# EAGLE design Cube_8x8x8_Mini_Control (EAGLE 9.6.2)
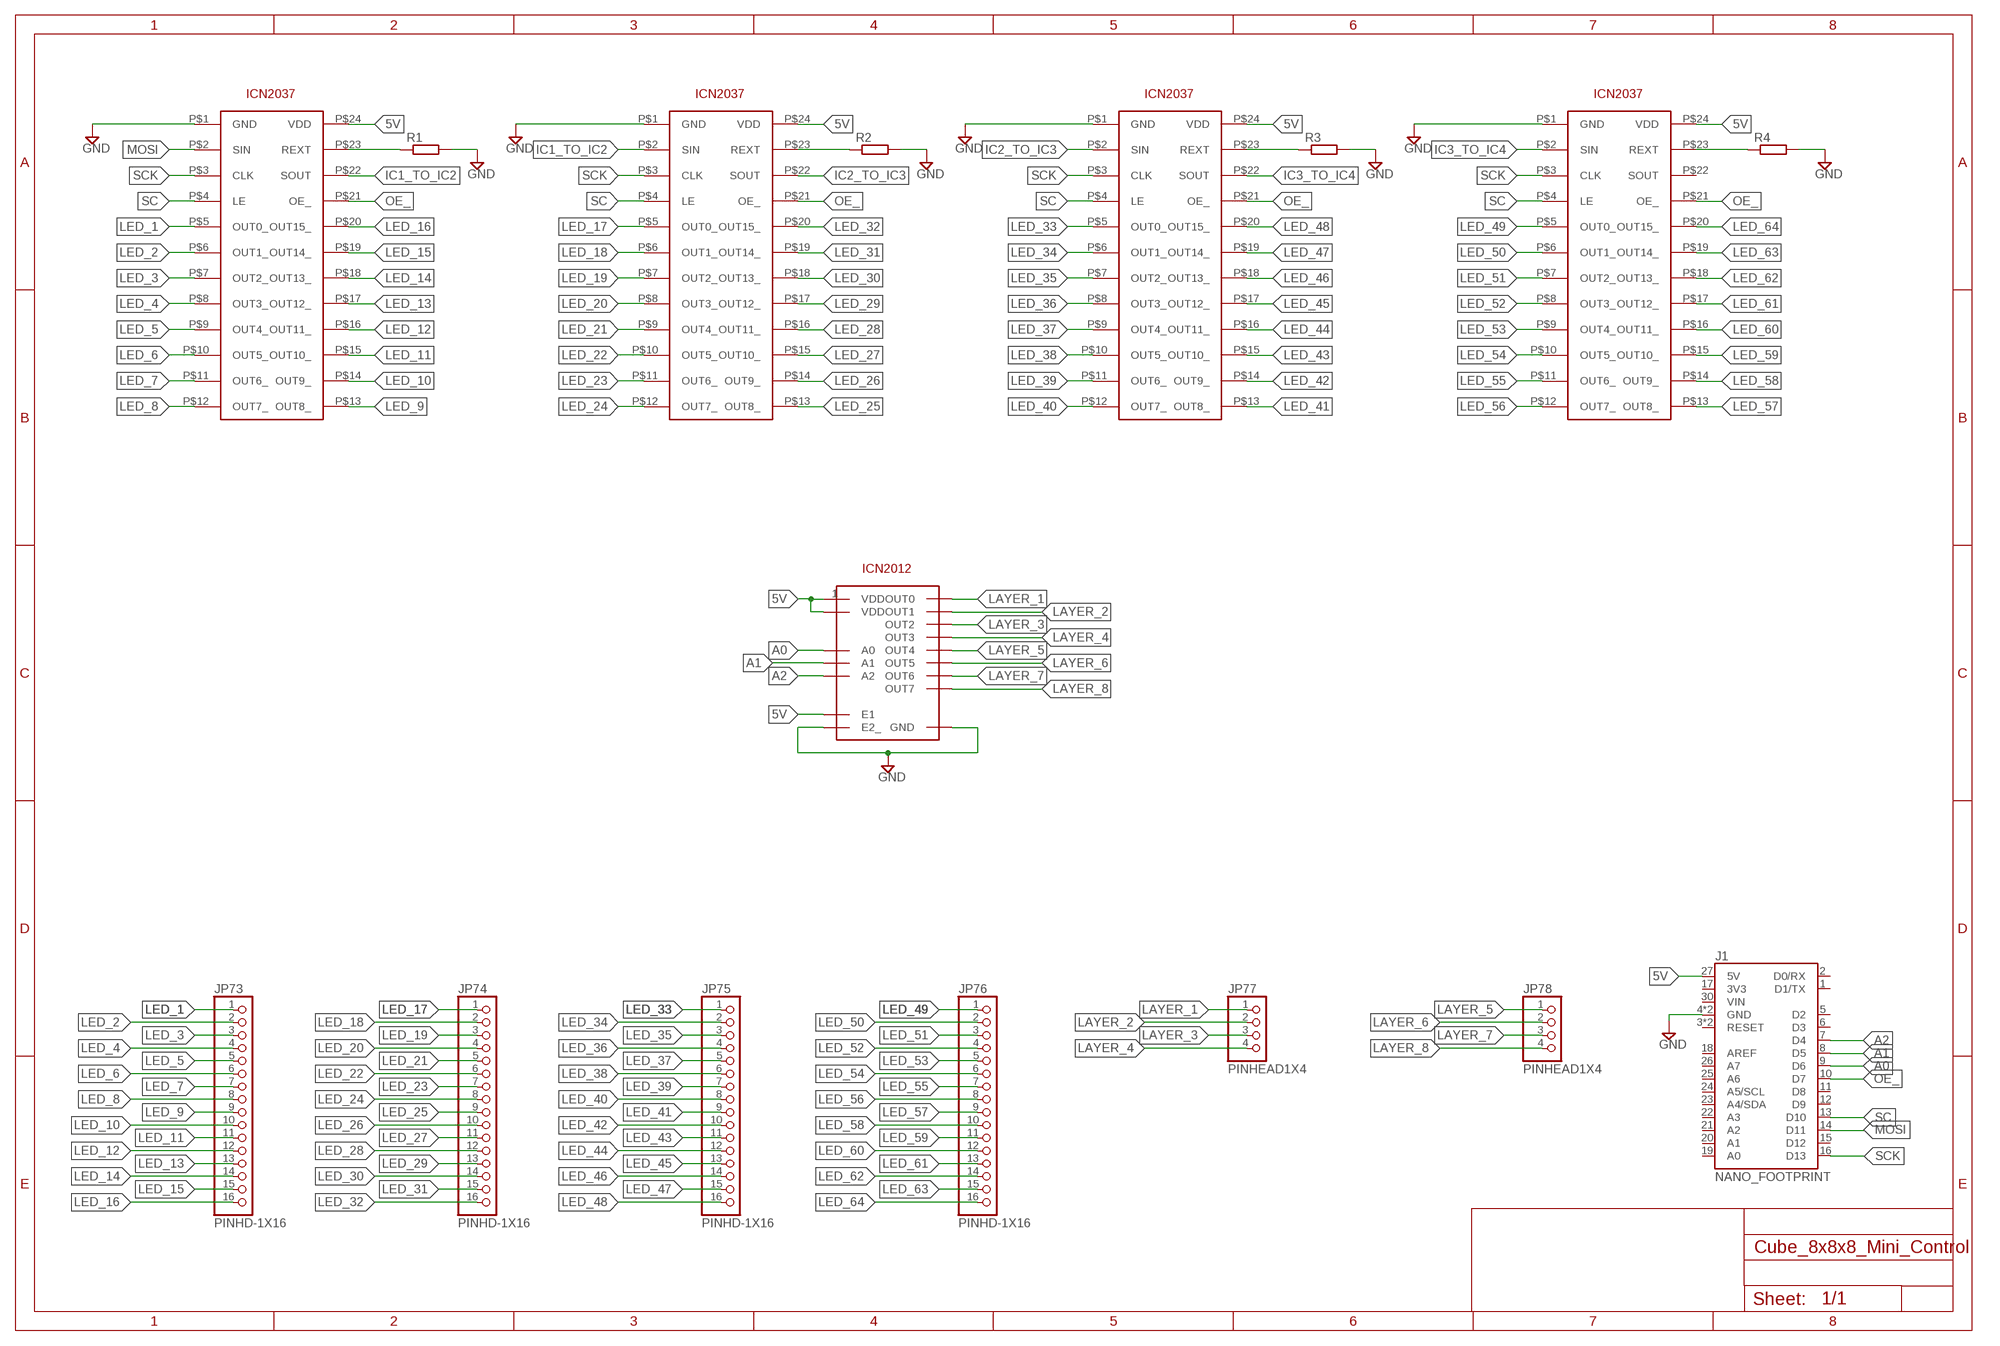
[diagram p0: schematic, sheet 1]

## Parts
J1  NANO_FOOTPRINT  [NANO]
JP73  PINHD-1X16  [2X16]
JP74  PINHD-1X16  [2X16]
JP75  PINHD-1X16  [2X16]
JP76  PINHD-1X16  [2X16]
JP77  PINHEAD1X4  [2X04]
JP78  PINHEAD1X4  [2X04]
R1  R-EU_R1206  [R1206]
R2  R-EU_R1206  [R1206]
R3  R-EU_R1206  [R1206]
R4  R-EU_R1206  [R1206]
U1  ICN2037  [SSOP24-P-150-0.635]
U2  ICN2037  [SSOP24-P-150-0.635]
U3  ICN2037  [SSOP24-P-150-0.635]
U4  ICN2037  [SSOP24-P-150-0.635]
U5  ICN2012  [SOP16]

## Nets
5V: J1.27(5V) U1.P$24(VDD) U2.P$24(VDD) U3.P$24(VDD) U4.P$24(VDD) U5.1(VDD) U5.7(E1) U5.9(VDD)
A0: J1.9(D6) U5.15(A0)
A1: J1.8(D5) U5.16(A1)
A2: J1.7(D4) U5.2(A2)
GND: J1.4(GND) J1.29(GND) R1.2 R2.2 R3.2 R4.2 U1.P$1(GND) U2.P$1(GND) U3.P$1(GND) U4.P$1(GND) U5.8(GND) U5.10(E2_)
IC1_TO_IC2: U1.P$22(SOUT) U2.P$2(SIN)
IC2_TO_IC3: U2.P$22(SOUT) U3.P$2(SIN)
IC3_TO_IC4: U3.P$22(SOUT) U4.P$2(SIN)
LAYER_1: JP77.1 U5.3(OUT0)
LAYER_2: JP77.2 U5.4(OUT1)
LAYER_3: JP77.3 U5.5(OUT2)
LAYER_4: JP77.4 U5.6(OUT3)
LAYER_5: JP78.1 U5.11(OUT4)
LAYER_6: JP78.2 U5.12(OUT5)
LAYER_7: JP78.3 U5.13(OUT6)
LAYER_8: JP78.4 U5.14(OUT7)
LED_1: JP73.1 U1.P$5(OUT0_)
LED_2: JP73.2 U1.P$6(OUT1_)
LED_3: JP73.3 U1.P$7(OUT2_)
LED_4: JP73.4 U1.P$8(OUT3_)
LED_5: JP73.5 U1.P$9(OUT4_)
LED_6: JP73.6 U1.P$10(OUT5_)
LED_7: JP73.7 U1.P$11(OUT6_)
LED_8: JP73.8 U1.P$12(OUT7_)
LED_9: JP73.9 U1.P$13(OUT8_)
LED_10: JP73.10 U1.P$14(OUT9_)
LED_11: JP73.11 U1.P$15(OUT10_)
LED_12: JP73.12 U1.P$16(OUT11_)
LED_13: JP73.13 U1.P$17(OUT12_)
LED_14: JP73.14 U1.P$18(OUT13_)
LED_15: JP73.15 U1.P$19(OUT14_)
LED_16: JP73.16 U1.P$20(OUT15_)
LED_17: JP74.1 U2.P$5(OUT0_)
LED_18: JP74.2 U2.P$6(OUT1_)
LED_19: JP74.3 U2.P$7(OUT2_)
LED_20: JP74.4 U2.P$8(OUT3_)
LED_21: JP74.5 U2.P$9(OUT4_)
LED_22: JP74.6 U2.P$10(OUT5_)
LED_23: JP74.7 U2.P$11(OUT6_)
LED_24: JP74.8 U2.P$12(OUT7_)
LED_25: JP74.9 U2.P$13(OUT8_)
LED_26: JP74.10 U2.P$14(OUT9_)
LED_27: JP74.11 U2.P$15(OUT10_)
LED_28: JP74.12 U2.P$16(OUT11_)
LED_29: JP74.13 U2.P$17(OUT12_)
LED_30: JP74.14 U2.P$18(OUT13_)
LED_31: JP74.15 U2.P$19(OUT14_)
LED_32: JP74.16 U2.P$20(OUT15_)
LED_33: JP75.1 U3.P$5(OUT0_)
LED_34: JP75.2 U3.P$6(OUT1_)
LED_35: JP75.3 U3.P$7(OUT2_)
LED_36: JP75.4 U3.P$8(OUT3_)
LED_37: JP75.5 U3.P$9(OUT4_)
LED_38: JP75.6 U3.P$10(OUT5_)
LED_39: JP75.7 U3.P$11(OUT6_)
LED_40: JP75.8 U3.P$12(OUT7_)
LED_41: JP75.9 U3.P$13(OUT8_)
LED_42: JP75.10 U3.P$14(OUT9_)
LED_43: JP75.11 U3.P$15(OUT10_)
LED_44: JP75.12 U3.P$16(OUT11_)
LED_45: JP75.13 U3.P$17(OUT12_)
LED_46: JP75.14 U3.P$18(OUT13_)
LED_47: JP75.15 U3.P$19(OUT14_)
LED_48: JP75.16 U3.P$20(OUT15_)
LED_49: JP76.1 U4.P$5(OUT0_)
LED_50: JP76.2 U4.P$6(OUT1_)
LED_51: JP76.3 U4.P$7(OUT2_)
LED_52: JP76.4 U4.P$8(OUT3_)
LED_53: JP76.5 U4.P$9(OUT4_)
LED_54: JP76.6 U4.P$10(OUT5_)
LED_55: JP76.7 U4.P$11(OUT6_)
LED_56: JP76.8 U4.P$12(OUT7_)
LED_57: JP76.9 U4.P$13(OUT8_)
LED_58: JP76.10 U4.P$14(OUT9_)
LED_59: JP76.11 U4.P$15(OUT10_)
LED_60: JP76.12 U4.P$16(OUT11_)
LED_61: JP76.13 U4.P$17(OUT12_)
LED_62: JP76.14 U4.P$18(OUT13_)
LED_63: JP76.15 U4.P$19(OUT14_)
LED_64: JP76.16 U4.P$20(OUT15_)
MOSI: J1.14(D11) U1.P$2(SIN)
N$1: R1.1 U1.P$23(REXT)
N$2: R2.1 U2.P$23(REXT)
N$3: R3.1 U3.P$23(REXT)
N$4: R4.1 U4.P$23(REXT)
OE_: J1.10(D7) U1.P$21(OE_) U2.P$21(OE_) U3.P$21(OE_) U4.P$21(OE_)
SC: J1.13(D10) U1.P$4(LE) U2.P$4(LE) U3.P$4(LE) U4.P$4(LE)
SCK: J1.16(D13) U1.P$3(CLK) U2.P$3(CLK) U3.P$3(CLK) U4.P$3(CLK)
Unconnected: J1.1(D1/TX) J1.2(D0/RX) J1.3(RESET) J1.5(D2) J1.6(D3) J1.11(D8) J1.12(D9) J1.15(D12) J1.17(3V3) J1.18(AREF) J1.19(A0) J1.20(A1) J1.21(A2) J1.22(A3) J1.23(A4/SDA) J1.24(A5/SCL) J1.25(A6) J1.26(A7) J1.28(RESET) J1.30(VIN) U4.P$22(SOUT)

## Library data of the parts
J1 = SparkFun-Boards:NANO_FOOTPRINT: Generic Nano Footprint
JP73-JP76 = pinhead1x16:PINHD-1X16
JP77 JP78 = pinhead1x4:PINHEAD1X4
R1-R4 = rcl:R-EU_: RESISTOR, European symbol; SPICEPREFIX: R
U1-U4 = ICN2037:ICN2037
U5 = ICN2012:ICN2012

## Board
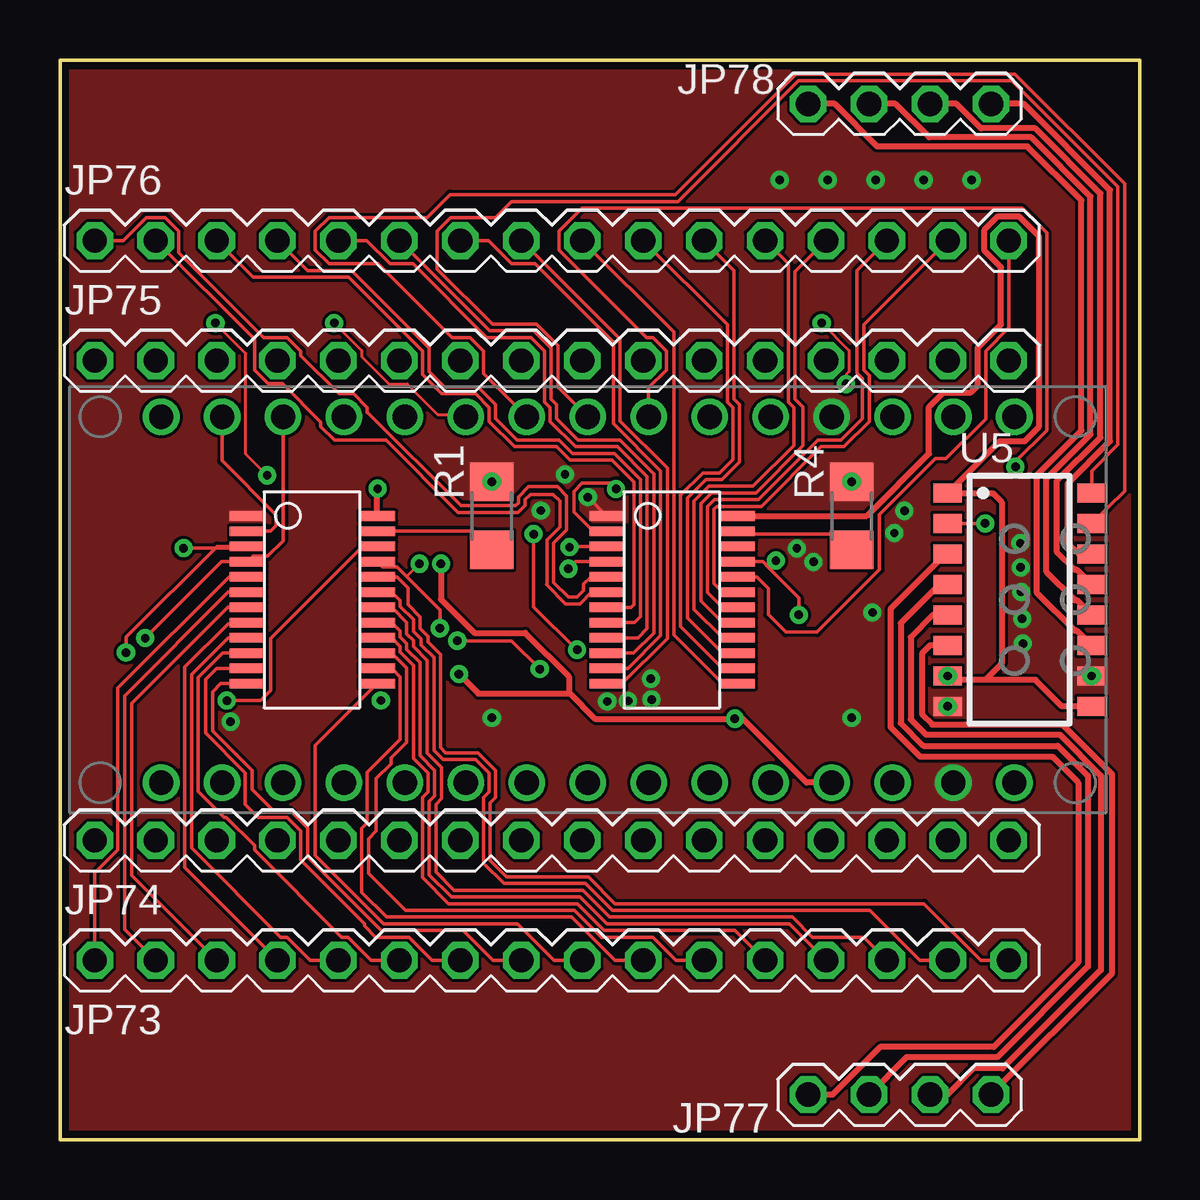
[diagram p1: board, top side]
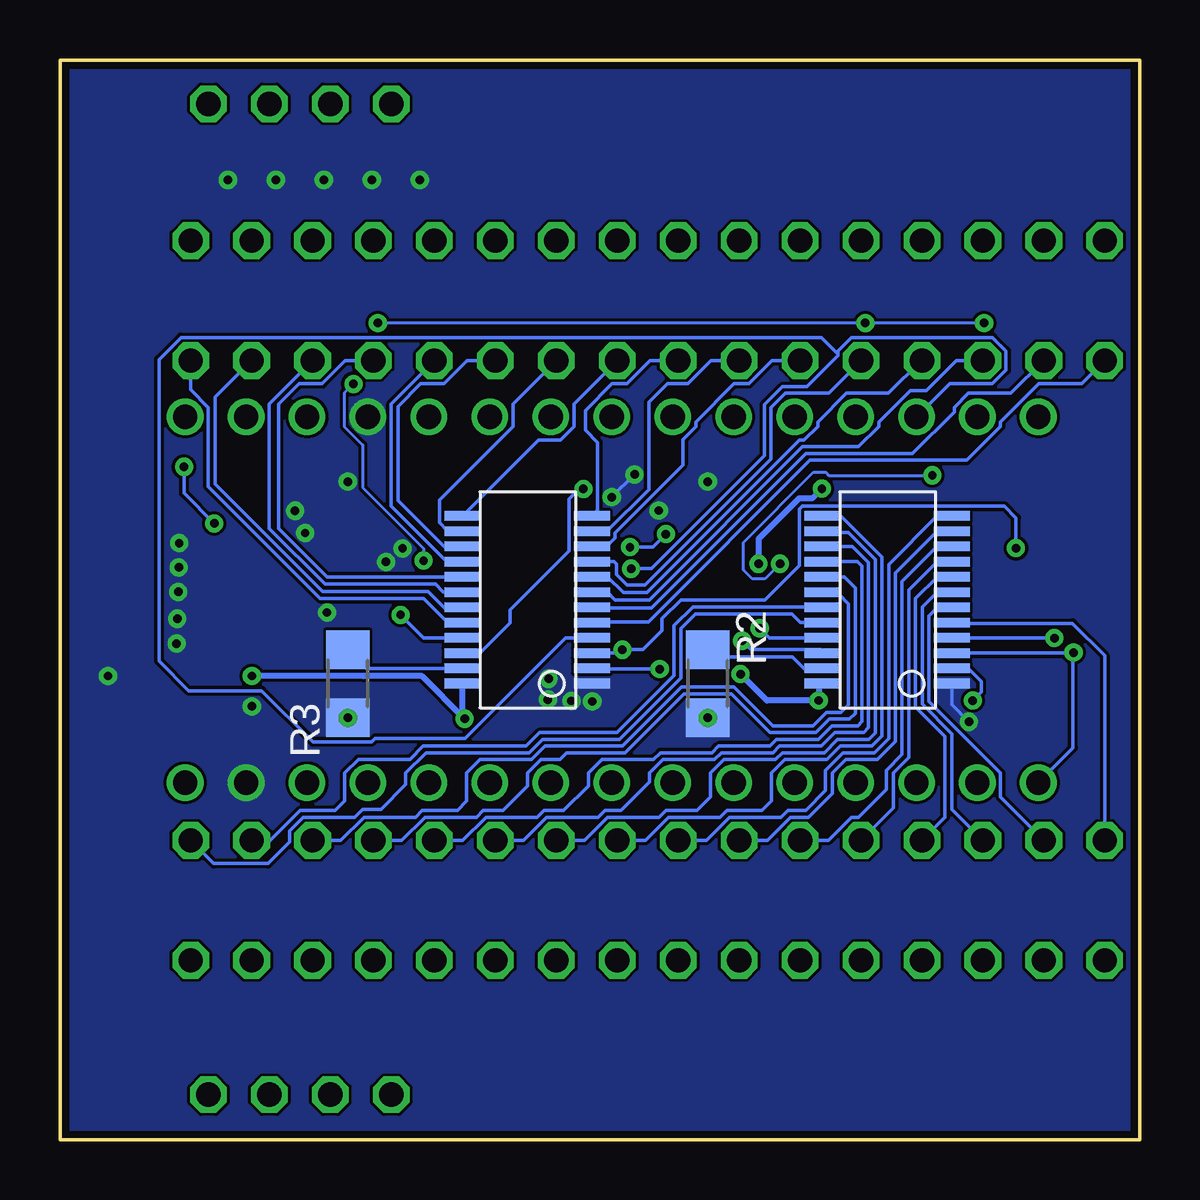
[diagram p2: board, bottom side, seen from below]

Size 45 x 45 mm. Coordinates in mm from the lower left corner, seen from the top.
Outline: 0,0 0,45 45,45 45,0 0,0
Copper layers (1*16): Top 0.035mm / dielectric 1.5mm / Bottom 0.035mm
Design rules "reglejlcpcb *": minimum track width 5mil, minimum drill 0.35mm, track to track 5mil, track to pad 5mil, pad to pad 5mil, via to via 5mil, smd to smd 5mil, copper to edge 0.3mm, drill to drill 20mil, minimum pad ring 10mil, minimum via ring 8mil, stop-mask expansion 4mil, vias tented up to drill 0mil, thermal gap 10mil

### Footprints (pad centres in the part's own frame; a part is rotated, then mirrored left to right if it is on the bottom)
NANO = drill 1.016: 1 -7.62,17.78; 2 -7.62,15.24; 3 -7.62,12.7; 4 -7.62,10.16; 5 -7.62,7.62; 6 -7.62,5.08; 7 -7.62,2.54; 8 -7.62,0; 9 -7.62,-2.54; 10 -7.62,-5.08; 11 -7.62,-7.62; 12 -7.62,-10.16; 13 -7.62,-12.7; 14 -7.62,-15.24; 15 -7.62,-17.78; 16 7.62,-17.78; 17 7.62,-15.24; 18 7.62,-12.7; 19 7.62,-10.16; 20 7.62,-7.62; 21 7.62,-5.08; 22 7.62,-2.54; 23 7.62,0; 24 7.62,2.54; 25 7.62,5.08; 26 7.62,7.62; 27 7.62,10.16; 28 7.62,12.7; 29 7.62,15.24; 30 7.62,17.78
2X16 = drill 1.016 octagon: 1 -19.05,1.27; 2 -16.51,1.27; 3 -13.97,1.27; 4 -11.43,1.27; 5 -8.89,1.27; 6 -6.35,1.27; 7 -3.81,1.27; 8 -1.27,1.27; 9 1.27,1.27; 10 3.81,1.27; 11 6.35,1.27; 12 8.89,1.27; 13 11.43,1.27; 14 13.97,1.27; 15 16.51,1.27; 16 19.05,1.27
2X04 = drill 1.016 octagon: 1 -3.81,1.27; 2 -1.27,1.27; 3 1.27,1.27; 4 3.81,1.27
R1206 = smd 1.6 x 1.803: 1 -1.422,0; 2 1.422,0
SSOP24-P-150-0.635 = smd 0.4 x 1.5: P$1 -3.491,-2.674; P$2 -2.856,-2.674; P$3 -2.221,-2.674; P$4 -1.586,-2.674; P$5 -0.951,-2.674; P$6 -0.316,-2.674; P$7 0.319,-2.674; P$8 0.954,-2.674; P$9 1.589,-2.674; P$10 2.224,-2.674; P$11 2.859,-2.674; P$12 3.494,-2.674; P$13 3.494,2.724; P$14 2.859,2.724; P$15 2.224,2.724; P$16 1.589,2.724; P$17 0.954,2.724; P$18 0.319,2.724; P$19 -0.316,2.724; P$20 -0.951,2.724; P$21 -1.586,2.724; P$22 -2.221,2.724; P$23 -2.856,2.724; P$24 -3.491,2.724
SOP16 = smd 0.8 x 1.2: 1 -4.445,-3; 2 -3.175,-3; 3 -1.905,-3; 4 -0.635,-3; 5 0.635,-3; 6 1.905,-3; 7 3.175,-3; 8 4.445,-3; 9 4.445,3; 10 3.175,3; 11 1.905,3; 12 0.635,3; 13 -0.635,3; 14 -1.905,3; 15 -3.175,3; 16 -4.445,3

### Placement (x,y rotation side)
J1  22,22.5 270 top
JP73  20.5,6.2 0 top
JP74  20.5,11.2 0 top
JP75  20.5,31.2 0 top
JP76  20.5,36.2 0 top
JP77  35,0.6 0 top
JP78  35,41.9 0 top
R1  18,26 90 top
R2  18,19 270 bottom
R3  33,19 270 bottom
R4  33,26 90 top
U1  10.5,22.5 270 top
U2  10.5,22.5 90 bottom
U3  25.5,22.5 90 bottom
U4  25.5,22.5 270 top
U5  40,22.5 270 top

### Tracks (layer width: path | path; a pad name or v marks a point on that pad's centre or on a via)
5V  (via drill 0.35)
  Top 0.152: 13.22,27.11 v13.24,27.13
  Top 0.254: 38.57,19.16 39.25,19.84 39.25,26.57 38.88,26.95 U5.1 39.16,29.1 40.2,29.1 40.8,29.7 40.8,37.66 39.97,38.49 39.1,38.49 38.53,37.92 38.53,37.05 39.22,36.36 39.22,33.97 38.26,33.01 38.26,31.43 37.96,31.14 36.82,31.14 36.22,30.54 36.22,28.59 33.63,25.99 U4.P$24 | 38.57,19.16 40.66,19.16 41.77,18.05 U5.9 | 38.57,19.16 37.28,19.16 37.12,19.32 U5.7 | J1.27 31.12,14.88 28.46,17.54 v28.13,17.54 22.3,17.54 21.25,18.59 | U1.P$24 13.22,27.11 | v16.63,19.4 17.44,18.59 21.25,18.59 | v15.88,24 15.88,22.52 17.28,21.12 19.39,21.12 21.21,19.3 21.21,18.63 21.25,18.59
  Bottom 0.254: U3.P$24 28.22,17.63 v28.13,17.54 29.9,19.31 32.36,19.31 32.37,19.32 U5.7 | U2.P$24 13.37,18.86 v13.37,18.3 15.53,18.3 v16.63,19.4 | v13.24,27.13 13.64,26.73 14.19,26.73 15.88,25.04 v15.88,24
  other vias: 37,19.32
A0
  Top 0.152: U5.15 43.67,26.34 43.68,26.34 44.38,27.04 44.38,39.83 39.8,44.41 30.67,44.41 25.65,39.39 16.26,39.39 15.3,38.44 11.21,38.44 10.64,37.87 10.64,37.07 11.21,36.51 13.27,36.51 16.34,33.44 17.09,33.44 17.66,32.87 17.66,31.93 J1.9
A1
  Top 0.152: U5.16 43,27.87 44.1,28.97 44.1,39.72 39.68,44.13 30.79,44.13 25.75,39.1 18.83,39.1 18.16,38.44 16.29,38.44 15.72,37.87 15.72,36.29 18.02,33.99 19.86,33.99 20.75,33.1 20.75,31.37 J1.8
A2  (via drill 0.35)
  Top 0.152: U5.2 v38.56,25.68 v38.57,25.68 | v39.83,28.04 39.83,28.27 41.13,29.56 41.13,37.8 40.11,38.82 21.75,38.82 20.8,37.87 20.8,37.07 24.44,33.44 24.71,33.44 25.27,32.87 25.27,32.07 24.54,31.34 J1.7
  Bottom 0.152: v38.57,25.68 39.83,26.94 v39.83,28.04
GND  (via drill 0.35)
  Top 0.152: U4.P$1 22.79,25.99 v22,26.78
  Bottom 0.127: 18.03,27.43 R1.2
  Bottom 0.152: v21.05,27.73 v22,26.78 | U2.P$1 7.83,18.13 v7.11,17.41
  other vias: 18,17.58 33,17.58 33,27.42 18,27.42 37,18.05 43,19.32 33.87,21.97 24.63,19.21 24.66,18.34 23.68,18.28 22.81,18.26 30.72,24.64 31.41,24.08 40.03,24.86 40.05,23.85 40.07,22.83 40.11,21.71 40.14,20.67 30,40 32,40 34,40 36,40 38,40 20.04,26.22 35.2,26.21 34.78,25.28
  pour Top (no thermals): -0.5,45.5 -0.5,-0.5 45.5,-0.5 45.5,45.5
  pour Bottom (no thermals): -1,46 -1,-1 46,-1 46,46
IC1_TO_IC2  (via drill 0.35)
  Top 0.152: U1.P$22 13.14,24.64 12.54,24.64 8.78,20.88 8.78,18.72 8.36,18.3 v6.95,18.3
  Bottom 0.152: v6.95,18.3 6.6,18.65 6.6,19.1 7.14,19.64 U2.P$2
IC2_TO_IC3  (via drill 0.35)
  Top 0.152: v16.56,20.79 18.82,20.79 v20,19.61
  Bottom 0.152: v16.56,20.79 16.19,20.42 13.28,20.42 13.22,20.36 U2.P$22 | v20,19.61 22.79,19.61 U3.P$2
IC3_TO_IC4  (via drill 0.35)
  Top 0.152: v23.18,27.12 22.93,27.37 21.77,27.37 21.42,27.02 21.42,26.16 22.22,25.36 U4.P$2
  Bottom 0.152: v23.18,27.12 23.36,27.12 23.78,26.7 23.78,24.53 26.24,22.07 26.24,21.53 27.49,20.28 U3.P$22
LAYER_1
  Top 0.254: U5.3 36.91,24.41 34.62,22.11 34.62,17.2 35.85,15.96 41.35,15.96 42.44,14.88 42.44,7.38 38.92,3.86 34.19,3.86 32.2,1.87 JP77.1
LAYER_2
  Top 0.254: U5.4 36.66,23.14 35.05,21.52 35.05,17.36 35.99,16.41 41.59,16.41 42.85,15.16 42.85,7.21 39.07,3.43 35.29,3.43 JP77.2
LAYER_3
  Top 0.254: U5.5 36.39,21.86 35.46,20.94 35.46,17.51 36.1,16.88 41.67,16.88 43.39,15.16 43.39,7.06 39.29,2.96 38.08,2.96 36.99,1.87 JP77.3
LAYER_4
  Top 0.254: U5.6 36.27,20.59 35.93,20.26 35.93,17.72 36.36,17.3 41.79,17.3 43.85,15.24 43.85,6.92 JP77.4
LAYER_5
  Top 0.254: U5.11 42.38,21.21 42.3,21.21 40.73,22.78 40.73,27.71 42.58,29.55 42.58,39.15 40.33,41.39 34.07,41.39 32.29,43.17 JP78.1
LAYER_6
  Top 0.254: U5.12 42.38,22.48 42.3,22.48 41.12,23.66 41.12,27.56 42.96,29.4 42.96,39.3 40.49,41.77 36.23,41.77 34.83,43.17 JP78.2
LAYER_7
  Top 0.254: U5.13 42.38,23.75 42.3,23.75 41.56,24.49 41.56,27.46 43.37,29.27 43.37,39.43 40.65,42.15 38.39,42.15 37.37,43.17 JP78.3
LAYER_8
  Top 0.254: U5.14 42.48,24.41 41.99,24.89 41.99,27.33 43.77,29.11 43.77,39.58 40.18,43.17 JP78.4
LED_1
  Top 0.152: JP73.1 1.45,11.11 2.42,12.07 2.42,18.82 7.05,23.45 U1.P$5
LED_2
  Top 0.152: U1.P$6 7.02,22.82 2.7,18.5 2.7,8.76 JP73.2
LED_3
  Top 0.152: U1.P$7 7.02,22.18 7,22.2 2.98,18.18 2.98,11.02 JP73.3
LED_4
  Top 0.152: U1.P$8 7.78,21.5 7,21.5 5.2,19.7 5.2,11.34 JP73.4
LED_5
  Top 0.152: U1.P$9 7.82,20.9 7,20.9 5.48,19.38 5.48,12.16 9.2,8.44 9.47,8.44 10.44,7.47 JP73.5
LED_6
  Top 0.152: JP73.6 12.97,7.47 12.01,8.44 11.74,8.44 8.11,12.07 8.11,12.26 6.93,13.44 6.84,13.44 5.76,14.52 5.76,19.26 6.77,20.28 U1.P$10
LED_7
  Top 0.152: U1.P$11 6.53,19.64 6.07,19.18 6.07,16.94 7.72,15.28 7.72,13.97 8.27,13.44 9.47,13.44 10.04,12.87 10.04,11.66 12.7,9 12.7,8.9 13.16,8.44 14.55,8.44 15.52,7.47 JP73.7
LED_8
  Top 0.152: U1.P$12 6.71,19.01 6.37,18.67 6.37,17.03 8.01,15.4 8.01,14.6 8.89,13.71 9.59,13.71 10.31,12.99 10.31,11.78 13.38,8.71 16.81,8.71 18.05,7.47 JP73.8
LED_9
  Top 0.152: U1.P$13 10.64,16.43 10.64,11.85 13.5,8.99 19.07,8.99 20.59,7.47 JP73.9
LED_10
  Top 0.152: U1.P$14 13.26,19.61 13.86,19.61 14.18,19.29 14.18,16.68 12.8,15.3 12.8,13.21 12.57,12.97 12.57,10.31 13.61,9.27 21.33,9.27 23.14,7.47 JP73.10
LED_11
  Top 0.152: U1.P$15 13.24,20.3 13.81,20.3 14.46,19.65 14.46,16.56 13.8,15.9 13.8,15.66 13.19,15.05 13.19,12.87 12.86,12.54 12.86,11.1 14.4,9.55 21.45,9.55 22.57,8.44 24.71,8.44 25.68,7.47 JP73.11
LED_12
  Top 0.152: U1.P$16 13.26,20.88 13.86,20.88 14.18,20.56 14.18,20.32 14.74,19.76 14.74,15.89 15.35,15.28 15.35,14.48 15.12,14.25 15.12,10.92 16.2,9.83 21.56,9.83 22.68,8.71 28.14,8.71 JP73.12
LED_13
  Top 0.152: U1.P$17 13.24,21.57 13.81,21.57 14.18,21.2 14.18,20.96 14.46,20.68 14.46,20.44 15.02,19.88 15.02,16 15.62,15.4 15.62,14.32 15.39,14.1 15.39,11.03 16.32,10.11 21.68,10.11 22.8,8.99 30.41,8.99 JP73.13
LED_14
  Top 0.152: U1.P$18 13.26,22.15 13.86,22.15 14.46,21.55 14.46,21.07 14.74,20.79 14.74,20.55 15.31,19.98 15.31,16.11 15.91,15.5 15.91,14.21 15.67,13.97 15.67,11.15 16.43,10.39 21.8,10.39 22.91,9.27 30.52,9.27 31.36,8.44 33.51,8.44 JP73.14
LED_15
  Top 0.152: JP73.15 35.84,7.47 33.75,9.55 23.03,9.55 21.91,10.67 18.5,10.67 17.66,11.52 17.66,14.25 17.89,14.48 17.89,15.28 17.32,15.85 15.96,15.85 15.59,16.22 15.59,20.09 15.06,20.62 15.06,20.86 14.74,21.19 14.74,21.67 14.18,22.23 14.18,22.47 13.86,22.79 13.26,22.79 U1.P$19
LED_16
  Top 0.152: U1.P$20 14.05,23.45 14.5,23 14.5,22.3 15.02,21.78 15.02,21.3 15.34,20.98 15.34,20.74 15.87,20.21 15.87,16.34 16.08,16.12 17.44,16.12 18.16,15.4 18.16,14.27 17.93,14.04 17.93,11.63 18.62,10.95 22.03,10.95 23.14,9.83 36.01,9.83 38.38,7.47 JP73.16
LED_17
  Bottom 0.152: U2.P$5 7.79,21.52 2.79,21.52 1.45,20.18 JP74.1
LED_18
  Bottom 0.152: U2.P$6 7.89,22.25 8.36,22.25 8.78,21.83 8.78,18.26 5.79,15.28 5.79,14.28 JP74.2
LED_19
  Bottom 0.152: JP74.3 7.83,13.77 7.83,16.92 9.06,18.15 9.06,22.19 8.46,22.79 7.86,22.79 U2.P$7
LED_20
  Bottom 0.152: U2.P$8 7.84,23.47 8.41,23.47 9.34,22.54 9.34,18.03 8.11,16.8 8.11,13.44 JP74.4
LED_21
  Bottom 0.152: U2.P$9 7.91,24.01 8.51,24.01 9.62,22.9 9.62,15.93 10.27,15.28 10.27,13.81 JP74.5
LED_22
  Bottom 0.152: U2.P$10 7.86,24.69 8.46,24.69 9.9,23.25 9.9,16.04 10.54,15.4 10.54,14.6 11.71,13.44 12.01,13.44 12.97,12.47 JP74.6
LED_23
  Bottom 0.152: U2.P$11 7.84,25.38 8.41,25.38 10.18,23.61 10.18,16.6 10.93,15.85 12.24,15.85 12.8,15.28 12.8,14.43 13.8,13.44 14.55,13.44 15.52,12.47 JP74.7
LED_24
  Bottom 0.152: U2.P$12 7.86,25.96 8.46,25.96 10.46,23.97 10.46,16.72 11.05,16.12 12.36,16.12 13.09,15.4 13.09,14.55 13.92,13.71 14.67,13.71 14.95,13.44 17.09,13.44 18.05,12.47 JP74.8
LED_25
  Bottom 0.152: U2.P$13 12.44,25.99 10.73,24.29 10.73,16.83 11.16,16.4 12.47,16.4 13.03,15.85 14.78,15.85 15.35,15.28 15.35,14.11 15.73,13.71 17.21,13.71 17.48,13.44 19.63,13.44 20.59,12.47 JP74.9
LED_26
  Bottom 0.152: U2.P$14 12.56,25.36 12.5,25.3 12.14,25.3 11.01,24.17 11.01,16.95 11.28,16.68 12.59,16.68 13.15,16.12 14.9,16.12 15.18,15.85 17.32,15.85 17.89,15.28 17.89,14.28 18.45,13.71 19.75,13.71 20.02,13.44 22.17,13.44 23.14,12.47 JP74.10
LED_27
  Bottom 0.152: U2.P$15 11.96,24.72 11.29,24.05 11.29,17.17 11.5,16.96 12.7,16.96 13.26,16.4 15.01,16.4 15.29,16.12 17.44,16.12 17.71,15.85 19.86,15.85 20.43,15.28 20.43,14.9 21.61,13.71 22.29,13.71 22.57,13.44 24.71,13.44 25.68,12.47 JP74.11
LED_28
  Bottom 0.152: U2.P$16 11.76,24.09 11.57,23.9 11.57,17.42 11.75,17.24 12.82,17.24 13.38,16.68 15.13,16.68 15.41,16.4 17.55,16.4 17.83,16.12 19.98,16.12 20.25,15.85 22.4,15.85 22.96,15.28 22.96,14.75 24,13.71 24.83,13.71 25.11,13.44 27.25,13.44 28.21,12.47 JP74.12
LED_29
  Bottom 0.152: U2.P$17 12.31,23.45 11.85,23 11.85,17.77 12.1,17.52 12.93,17.52 13.49,16.96 15.4,16.96 17.01,18.58 18.99,18.58 21.44,16.12 23.88,16.12 24.16,15.85 24.94,15.85 25.5,15.28 25.5,14.75 26.54,13.71 27.37,13.71 27.64,13.44 29.79,13.44 30.75,12.47 JP74.13
LED_30
  Bottom 0.152: U2.P$18 13.14,22.74 12.54,22.74 12.13,22.33 12.13,18.12 12.45,17.8 13.05,17.8 13.61,17.24 15.28,17.24 16.9,18.86 19.1,18.86 21.56,16.4 24.78,16.4 25.34,15.84 26.68,15.84 26.68,15.85 27.48,15.85 28.05,15.28 28.05,14.11 28.43,13.71 29.91,13.71 30.18,13.44 31.53,13.44 | 31.53,13.44 32.33,13.44 33.3,12.47 JP74.14 | 31.53,13.44
LED_31
  Bottom 0.152: U2.P$19 13.24,22.2 18.62,22.2 19.4,21.42 19.4,19.35 21.79,16.96 25.01,16.96 25.57,16.4 29.86,16.4 30.41,15.85 32.56,15.85 33.12,15.28 33.12,14.12 33.53,13.71 34.99,13.71 36.23,12.47 JP74.15
LED_32
  Bottom 0.152: U2.P$20 14.13,21.55 14.48,21.9 18.51,21.9 19.11,21.3 19.11,19.25 21.67,16.68 24.89,16.68 25.46,16.12 26.56,16.12 29.74,16.12 30.59,15.28 30.59,14.8 31.62,13.77 32.39,13.77 32.73,13.44 34.87,13.44 35.44,12.87 35.44,12.4 36.33,11.51 38.59,11.51 JP74.16
LED_33
  Bottom 0.152: U3.P$5 22.79,21.58 20.47,21.58 13.74,28.32 7.2,28.32 5.79,29.72 5.79,29.91 4.2,31.5 2.42,31.5 JP75.1
LED_34
  Bottom 0.152: U3.P$6 22.81,22.16 20.34,22.16 13.9,28.6 9.46,28.6 7.72,30.33 7.72,30.52 7.14,31.11 5.36,31.11 JP75.2
LED_35
  Bottom 0.152: U3.P$7 22.18,22.82 21.86,22.5 20.44,22.5 14.06,28.88 11.72,28.88 10.88,29.72 10.88,29.91 9.56,31.23 8.88,31.23 7.63,32.47 JP75.3
LED_36
  Bottom 0.152: U3.P$8 22.18,23.45 21.52,22.8 20.53,22.8 14.18,29.16 13.98,29.16 13.41,29.72 13.41,29.91 12.22,31.11 10.46,31.11 9.1,32.47 JP75.4
LED_37
  Bottom 0.152: JP75.5 11.61,32.45 12.95,31.11 14.76,31.11 15.36,30.51 15.36,28.37 20.61,23.11 21.36,23.11 21.81,23.56 21.81,23.99 21.91,24.09 U3.P$9
LED_38
  Bottom 0.152: U3.P$10 22.22,24.72 21.87,25.07 21.87,25.28 19.04,28.12 19.04,29.18 18.5,29.72 18.5,29.91 16.9,31.5 16.29,31.5 15.32,32.47 JP75.6
LED_39
  Bottom 0.152: U3.P$11 22.81,25.34 22.21,25.34 20.45,27.1 20.45,30.73 19.68,31.5 18.83,31.5 17.86,32.47 JP75.7
LED_40
  Bottom 0.152: U3.P$12 22.59,26.23 22.59,29.05 23.09,29.56 23.09,30.39 21.98,31.5 21.37,31.5 20.41,32.47 JP75.8
LED_41
  Bottom 0.152: JP75.9 23.57,30.66 23.57,29.72 24.14,29.16 25.06,29.16 U3.P$13
LED_42
  Bottom 0.152: JP75.10 26.11,30.66 26.11,29.72 29.18,26.66 29.18,25.71 28.86,25.39 28.25,25.39 U3.P$14
LED_43
  Bottom 0.152: U3.P$15 29,24.72 30.91,26.64 30.91,30.55 29.96,31.5 28.99,31.5 28.02,32.47 JP75.11
LED_44
  Bottom 0.152: U3.P$16 28.88,24.09 31.2,26.41 31.2,30.66 JP75.12
LED_45
  Bottom 0.152: U3.P$17 33.87,23.45 35.88,25.47 35.88,30.66 35.04,31.5 34.07,31.5 33.1,32.47 JP75.13
LED_46
  Bottom 0.152: U3.P$18 29.02,22.82 29.35,23.15 33.96,23.15 36.27,25.46 36.27,30.66 JP75.14
LED_47
  Bottom 0.152: U3.P$19 28.99,22.18 29.65,22.84 34.05,22.84 38.53,27.33 38.53,30.95 JP75.15
LED_48
  Bottom 0.152: U3.P$20 28.83,21.55 29.84,22.56 34.16,22.56 38.81,27.21 38.81,30.52 39.55,31.25 JP75.16
LED_49
  Top 0.152: JP76.1 2.62,37.47 3.59,38.44 4.39,38.44 4.96,37.87 4.96,36.96 8.48,33.44 9.47,33.44 10.04,32.87 10.04,32.68 11.63,31.09 12.24,31.09 12.8,30.52 12.8,30.31 12.82,30.31 16.72,26.42 18.99,26.42 19.11,26.54 19.11,26.79 19.53,27.21 20.73,27.21 21.12,26.82 21.12,25.41 20.58,24.87 20.58,23.23 21.2,22.61 21.56,22.61 21.83,22.88 21.83,23.15 22.13,23.45 U4.P$5 22.76,23.38
LED_50
  Top 0.152: U4.P$6 22.17,22.82 21.68,22.33 21.08,22.33 20.3,23.11 | JP76.2 8.11,33.35 8.11,32.07 8.67,31.5 9.28,31.5 10.88,29.91 10.88,29.72 11.44,29.16 13.59,29.16 16.6,26.14 19.1,26.14 19.38,26.42 19.38,26.67 19.61,26.89 20.56,26.89 20.84,26.61 20.84,25.53 20.3,24.98 20.3,23.11 | 20.28,23.13 20.3,23.11
LED_51
  Top 0.152: U4.P$7 23.8,22.18 23.92,22.3 23.92,27.4 23,28.32 21.25,28.32 20.69,28.88 18.94,28.88 17.89,29.93 17.89,30.52 17.32,31.09 15.91,31.09 15.12,31.89 15.12,32.87 12.04,35.95 8.05,35.95 JP76.3
LED_52
  Top 0.152: U4.P$8 23.94,21.55 24.2,21.8 24.2,27.52 23.12,28.6 21.37,28.6 20.81,29.16 19.06,29.16 18.16,30.05 18.16,30.64 17.44,31.36 16.03,31.36 15.39,32 15.39,32.99 12.15,36.23 10.31,36.23 JP76.4
LED_53
  Top 0.152: U4.P$9 24.09,20.91 24.48,21.3 24.48,27.63 23.23,28.88 21.48,28.88 20.43,29.93 20.43,30.52 20.2,30.75 20.2,32.87 19.63,33.44 17.79,33.44 14.72,36.51 13.75,36.51 12.79,37.47 JP76.5
LED_54
  Top 0.152: U4.P$10 23.91,20.28 24.76,21.12 24.76,27.75 23.35,29.16 21.6,29.16 20.7,30.05 20.7,30.64 20.48,30.87 20.48,32.99 19.75,33.72 17.91,33.72 JP76.6
LED_55
  Top 0.152: U4.P$11 23.67,19.64 25.04,21.01 25.04,27.86 23.07,29.83 23.07,33.24 19.8,36.51 18.83,36.51 17.86,37.47 JP76.7
LED_56
  Top 0.152: U4.P$12 23.43,19.01 25.31,20.89 25.31,27.98 23.34,29.95 23.34,33.35 JP76.8
LED_57
  Top 0.152: U4.P$13 28.2,18.99 27.64,18.99 25.59,21.03 25.59,33.65 JP76.9
LED_58
  Top 0.152: U4.P$14 28.2,19.62 27.64,19.62 25.87,21.39 25.87,26.85 26.81,27.79 27.48,27.79 28.05,28.35 28.05,30.52 27.82,30.75 27.82,33.97 JP76.10
LED_59
  Top 0.152: U4.P$15 28.2,20.26 27.64,20.26 26.15,21.75 26.15,26.74 26.93,27.51 27.6,27.51 28.32,28.24 28.32,30.64 28.09,30.87 28.09,36.23 JP76.11
LED_60
  Top 0.152: U4.P$16 28.19,20.94 27.59,20.94 26.43,22.1 26.43,26.62 27.04,27.23 28.88,27.23 30.59,28.93 30.59,30.52 30.36,30.75 30.36,36.51 JP76.12
LED_61
  Top 0.152: U4.P$17 28.2,21.53 27.64,21.53 26.71,22.46 26.71,26.51 27.16,26.95 29,26.95 30.96,28.92 30.96,30.54 30.64,30.87 30.64,36.17 JP76.13
LED_62
  Top 0.152: U4.P$18 28.2,22.16 27.64,22.16 26.99,22.81 26.99,26.39 27.27,26.67 29.12,26.67 31.6,29.16 32.56,29.16 33.45,30.05 33.45,31.72 33.23,31.95 33.23,36.23 JP76.14
LED_63
  Top 0.152: U4.P$19 28.19,22.85 27.59,22.85 27.27,23.17 27.27,26.28 27.39,26.39 29.23,26.39 31.71,28.88 32.68,28.88 33.73,29.93 33.73,31.84 33.51,32.07 33.51,33.97 JP76.15
LED_64
  Top 0.152: JP76.16 39.55,33.84 38.59,32.87 38.59,30.04 36.92,28.38 36.49,28.38 34.16,26.06 34.16,23.75 31.56,21.15 30.26,21.15 29.53,21.88 29.53,22.98 29.05,23.45 U4.P$20
MOSI
  Top 0.152: J1.14 6.76,28.3 9.02,26.03 9.02,25.6 8.78,25.36 U1.P$2
N$1
  Top 0.152: R1.1 17.22,25.36 U1.P$23
N$2
  Bottom 0.152: R2.1 17.69,20.11 14.47,20.11 13.93,19.57 13.29,19.57 U2.P$23
N$3
  Bottom 0.152: U3.P$23 32.22,19.64 R3.1
N$4
  Top 0.152: R4.1 32.33,25.25 28.33,25.25 U4.P$23
OE_  (via drill 0.35)
  Top 0.127: v11.43,34.04 12.57,32.89 12.57,32.64 13.72,31.5 14.48,31.5 15.75,30.23 16.89,30.23 J1.10 | v6.48,34.04 7.75,32.77 7.75,28.57 v8.64,27.69 | 14.45,23.46 v14.99,24 | v29.84,24.13 29.55,23.83 | v32.77,31.5 32.77,31.88 32.89,32 32.89,32.89 v31.75,34.04
  Top 0.152: U1.P$21 13.46,23.86 14.06,23.86 14.45,23.46 15.84,22.08 v15.84,21.32 | U4.P$21 29.29,24.09 29.55,23.83 30.8,22.58 v30.8,21.87
  Bottom 0.127: v6.48,34.04 v11.43,34.04 v31.75,34.04 | v8.64,27.69 12.95,27.69 13.08,27.81 13.59,27.81 16.51,24.89 16.51,23.75 16.13,23.37 15.62,23.37 v14.99,24 | v29.84,24.13 29.84,24.64 32.38,27.18 32.38,28.96 33.15,29.72 33.15,31.11 v32.77,31.5
  Bottom 0.152: v15.84,21.32 15.43,20.91 U2.P$21 | v30.8,21.87 29.84,20.91 U3.P$21
SC  (via drill 0.35)
  Top 0.152: J1.13 9.3,24.96 8.66,24.32 8.06,24.32 U1.P$4 6.74,24.09 v3.55,20.9 | U4.P$4 21.49,24.09 v21.2,23.79
  Bottom 0.152: U2.P$4 3.56,20.91 v3.55,20.9 | v21.2,23.79 20.35,23.79 15.63,28.51 15.63,30.63 14.88,31.38 13.87,31.38 12.57,32.68 12.57,32.75 | 12.57,32.75 12.57,32.87 12.01,33.44 6.13,33.44 5.57,32.87 5.57,32.07 6.13,31.5 7.92,31.5 J1.13 | U3.P$4 23.93,20.91 28.12,16.73 31.86,16.73 32.01,16.57 34.45,16.57 36.59,18.71 39.63,18.71 40.87,19.95 40.87,32.52 39.95,33.44 13.26,33.44 12.57,32.75
SCK  (via drill 0.35)
  Top 0.152: v2.75,20.3 2.77,20.32 2.77,20.94 6.55,24.72 U1.P$3 7.75,24.65 v5.15,24.65 | U4.P$3 21.33,24.72 21.29,24.68 21.25,24.68 v21.24,24.7 | v19.75,25.24 19.75,22.2 21.53,20.42 v21.56,20.42
  Bottom 0.152: U2.P$3 2.77,20.28 | 2.77,20.28 v2.75,20.3 | U3.P$3 22.82,20.29 21.69,20.29 v21.56,20.42 20.7,20.42 19.9,21.22 19.9,21.71 19.12,22.48 15.62,22.48 14.18,23.92 14.18,26.28 14.06,26.4 5.63,26.4 5.15,25.91 v5.15,24.65 | J1.16 2.77,16.33 2.77,20.28 | v21.24,24.7 20.29,24.7 v19.75,25.24